# EAGLE design StasDuino_Schematic (EAGLE 9.5.2)
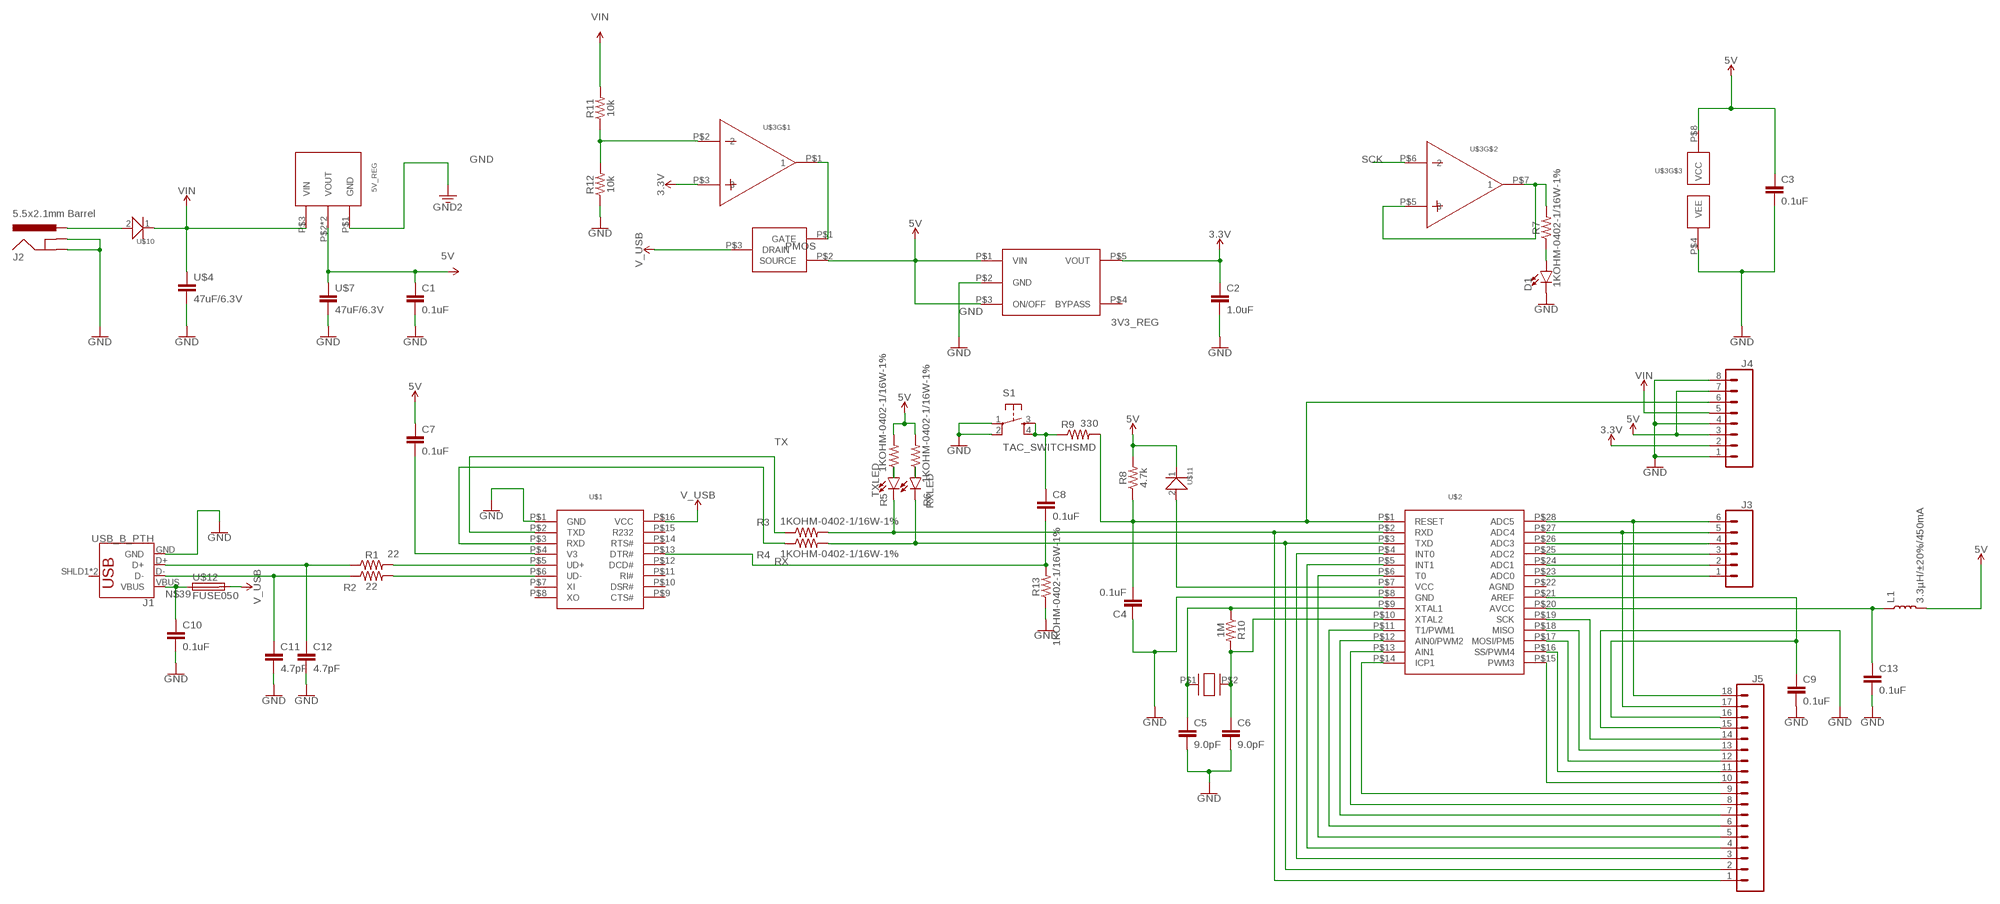
[diagram p0: schematic, sheet 1]

## Parts
3V3_REG  3V3_REGULATOR  [3V3-REGULATOR]
5V_REG  5V_REGULATOR  [5V_REGULATOR]
C1  0.1uF  0.1UF-0402-16V-10%  [0402]
C2  1.0uF  1.0UF-0402-16V-10%  [0402]
C3  0.1uF  0.1UF-0402-16V-10%  [0402]
C4  0.1uF  0.1UF-0402-16V-10%  [0402]
C5  9.0pF  9.0PF-0603-50V-10%  [0603]
C6  9.0pF  9.0PF-0603-50V-10%  [0603]
C7  0.1uF  0.1UF-0402-16V-10%  [0402]
C8  0.1uF  0.1UF-0402-16V-10%  [0402]
C9  0.1uF  0.1UF-0402-16V-10%  [0402]
C10  0.1uF  0.1UF-0402-16V-10%  [0402]
C11  4.7pF  4.7PF-0603-50V-5%  [0603]
C12  4.7pF  4.7PF-0603-50V-5%  [0603]
C13  0.1uF  0.1UF-0402-16V-10%  [0402]
D1  LED0603  [LED-0603]
J1  USB_B_PTH  [USB-B-PTH]
J2  5.5x2.1mm Barrel  POWER_JACKSMD  [POWER_JACK_SMD]
J3  CONN_06NO_SILK_FEMALE_PTH  [1X06_NO_SILK]
J4  CONN_08NO_SILK_FEMALE_PTH  [1X08_NO_SILK]
J5  CONN_18  [1X18_NO_SILK]
L1  3.3µH/±20%/450mA  INDUCTOR-0805-3.3UH  [0805]
PMOS  PMOS  [PMOSFET]
R1  22  22OHM-0402-1/10W-1%  [0402]
R2  22  22OHM-0402-1/10W-1%  [0402]
R3  1KOHM-0402-1/16W-1%  [0402]
R4  1KOHM-0402-1/16W-1%  [0402]
R5  1KOHM-0402-1/16W-1%  [0402]
R6  1KOHM-0402-1/16W-1%  [0402]
R7  1KOHM-0402-1/16W-1%  [0402]
R8  4.7k  4.7KOHM-0603-1/10W-1%  [0603]
R9  330  330OHM-0603-1/10W-1%  [0603]
R10  1M  1MOHM-0603-1/4W-5%  [0603]
R11  10k  10KOHM-0402-1/16W-1%  [0402]
R12  10k  10KOHM-0402-1/16W-1%  [0402]
R13  1KOHM-0402-1/16W-1%  [0402]
RXLED  LED0603  [LED-0603]
S1  TAC_SWITCHSMD  [TACTILE-SWITCH-SMD]
TXLED  LED0603  [LED-0603]
U$1  CH340C  [CH340G/C]
U$2  ATMEGA328P  [ATMEGA328P]
U$3  DUAL_OPAMP  [DUAL_OPAMP]
U$4  47uF/6.3V  47UF  [0805]
U$7  47uF/6.3V  47UF  [0805]
U$8  CRYSTAL  [CRYSTAL]
U$10  DIODE_GEN_PURPDIODE  [0402]
U$11  DIODE_GEN_PURPDIODE  [0402]
U$12  FUSE050  [MF-SMDF050]

## Nets
3.3V: 3V3_REG.P$5(VOUT) C2.1 J4.2 U$3.P$3
5V: 3V3_REG.P$1(VIN) 3V3_REG.P$3(ON/OFF) 5V_REG.P$2(VOUT) 5V_REG.P$2B(VOUT) C1.1 C3.1 C7.1 J4.3 J4.7 L1.2 PMOS.P$2(SOURCE) R5.2 R6.2 R8.2 U$3.P$8(VCC) U$7.1 U$11.1
D+: R1.2 U$1.P$5(UD+)
GND: 3V3_REG.P$2(GND) 5V_REG.P$1(GND) C1.2 C2.2 C3.2 C4.1 C5.2 C6.2 C9.2 C10.2 C11.2 C12.2 C13.2 D1.C J1.GND J2.GND(GNDBREAK) J2.P$4(GND) J4.1 J4.4 J4.8 J5.15 R12.1 R13.1 S1.1 S1.2 U$1.P$1(GND) U$2.P$8(GND) U$3.P$4(VEE) U$4.2 U$7.2 ; supply symbol labelled GND2
N$1: C12.1 J1.D+ R1.1
N$2: C4.2 J4.6 R8.1 R9.2 U$2.P$1(RESET)
N$3: C11.1 J1.D- R2.1
N$4: R2.2 U$1.P$6(UD-)
N$5: J5.2 R4.2 RXLED.C U$2.P$3(TXD)
N$6: J5.1 R3.2 TXLED.C U$2.P$2(RXD)
N$7: C8.1 R9.1 S1.3 S1.4
N$8: R5.1 TXLED.A
N$9: R6.1 RXLED.A
N$10: D1.A R7.1
N$11: R7.2 U$3.P$5 U$3.P$7
N$12: C5.1 R10.1 U$2.P$9(XTAL1) U$8.P$1
N$13: C6.1 R10.2 U$2.P$10(XTAL2) U$8.P$2
N$14: J3.6 J5.18 U$2.P$28(ADC5)
N$15: PMOS.P$1(GATE) U$3.P$1
N$16: J2.VIN0(PWR) U$10.2
N$17: R11.1 R12.2 U$3.P$2
N$18: C7.2 U$1.P$4(V3)
N$19: C8.2 R13.2 U$1.P$13(DTR#)
N$20: U$2.P$7(VCC) U$11.2
N$21: J3.5 J5.17 U$2.P$27(ADC4)
N$22: J3.4 U$2.P$26(ADC3)
N$23: J3.3 U$2.P$25(ADC2)
N$24: J3.2 U$2.P$24(ADC1)
N$25: J3.1 U$2.P$23(ADC0)
N$26: J5.3 U$2.P$4(INT0)
N$27: J5.4 U$2.P$5(INT1)
N$28: J5.5 U$2.P$6(T0)
N$29: J5.6 U$2.P$11(T1/PWM1)
N$30: J5.7 U$2.P$12(AIN0/PWM2)
N$31: J5.8 U$2.P$13(AIN1)
N$32: J5.9 U$2.P$14(ICP1)
N$33: J5.10 U$2.P$15(PWM3)
N$34: J5.11 U$2.P$16(SS/PWM4)
N$35: J5.12 U$2.P$17(MOSI/PM5)
N$36: J5.13 U$2.P$18(MISO)
N$37: J5.14 U$2.P$19(SCK)
N$38: C9.1 J5.16 U$2.P$21(AREF)
N$39: C10.1 J1.VBUS U$12.1
N$40: C13.1 L1.1 U$2.P$20(AVCC)
RX: R4.1 U$1.P$3(RXD)
SCK: U$3.P$6
TX: R3.1 U$1.P$2(TXD)
V_USB: PMOS.P$3(DRAIN) U$1.P$16(VCC) U$12.2
VIN: 5V_REG.P$3(VIN) J4.5 R11.2 U$4.1 U$10.1
Unconnected: 3V3_REG.P$4(BYPASS) J1.SHLD1(SHIELD) J1.SHLD2(SHIELD) U$1.P$7(XI) U$1.P$8(XO) U$1.P$9(CTS#) U$1.P$10(DSR#) U$1.P$11(RI#) U$1.P$12(DCD#) U$1.P$14(RTS#) U$1.P$15(R232) U$2.P$22(AGND)

## Library data of the parts
3V3_REG = StasDuino_Lib:3V3_REGULATOR
5V_REG = StasDuino_Lib:5V_REGULATOR
C1 C3 C4 C7-C10 C13 = StasDuino_Lib:0.1UF: 0.1µF ceramic capacitors A capacitor is a passive two-terminal electrical component used to store electrical energy temporarily in an electric field.; PROD_ID: CAP-12416
C2 = StasDuino_Lib:1.0UF: 1µF ceramic capacitors A capacitor is a passive two-terminal electrical component used to store electrical energy temporarily in an electric field.; PROD_ID: CAP-12417
C5 C6 = SparkFun-Capacitors:9.0PF: 9.0pF ceramic capacitors A capacitor is a passive two-terminal electrical component used to store electrical energy temporarily in an electric field.; PROD_ID: CAP-09341
C11 C12 = SparkFun-Capacitors:4.7PF: 4.7pF ceramic capacitors A capacitor is a passive two-terminal electrical component used to store electrical energy temporarily in an electric field.; PROD_ID: CAP-07880
D1 RXLED TXLED = StasDuino_Lib:LED: LED (Generic) Standard schematic elements and footprints for 5mm, 3mm, 1206, and 0603 sized LEDs. Generic LEDs with no color specified.
J1 = StasDuino_Lib:USB_B: USB Type B Connector SparkFun Products: SparkFun Stepoko <https://www.sparkfun.com/products/13899> PTH; PROD_ID: CONN-08278; SF_ID: PRT-00139
J2 = StasDuino_Lib:POWER_JACK: Power Jack Connector This is the standard 5.5mm barrel jack for power. The PTH is the most common, proven, reliable, footprint. The Slot footprint only works if the mill layer is transmitted to the PCB fab house so be warned. Here are the connectors we sell at SparkFun: DC Barrel Power Jack/Connector <https://www.sparkfun.com/products/119> (PRT-00119) DC Barrel Power Jack/Connector (SMD) <https://www.sparkfun.com/products/12748> (PRT-12748) DC Barrel Jack Adapter - Breadboard Compatible <https://www.sparkfun.com/products/10811> (PRT-10811) It is used on this SparkFun product (and many, many others): SparkFun RedBoard - Programmed with Arduino <https://www.sparkfun.com/products/12757> (DEV-12757) Also, if you need a mating power supply or connector, please check these out: Wall Adapter Power Supply - 9VDC 650mA <https://www.sparkfun.com/products/298> (TOL-00298) DC Barrel Jack Adapter - Male <https://www.sparkfun.com/products/10287> (PRT-10287); PROD_ID: CONN-08106; SF_ID: PRT-12748
J3 = StasDuino_Lib:CONN_06: Multi connection point. Often used as Generic Header-pin footprint for 0.1 inch spaced/style header connections On any of the 0.1 inch spaced packages, you can populate with these: Break Away Headers - Straight <https://www.sparkfun.com/products/116> (PRT-00116) Break Away Male Headers - Right Angle <https://www.sparkfun.com/products/553> (PRT-00553) Female Headers <https://www.sparkfun.com/products/115> (PRT-00115) Break Away Headers - Machine Pin <https://www.sparkfun.com/products/117> (PRT-00117) Break Away Female Headers - Swiss Machine Pin <https://www.sparkfun.com/products/743> (PRT-00743) Arduino Stackable Header - 6 Pin <https://www.sparkfun.com/products/9280> (PRT-09280) For SCREWTERMINALS and SPRING TERMINALS visit here: Screw Terimnals on SparkFun.com <https://www.sparkfun.com/search/results?term=Screw+Terminals> (5mm/3.5mm/2.54mm spacing) This device is also useful as a general connection point to wire up your design to another part of your project. Our various solder wires solder well into these plated through hole pads. Hook-Up Wire - Assortment (Stranded, 22 AWG) <https://www.sparkfun.com/products/11375> (PRT-11375) Hook-Up Wire - Assortment (Solid Core, 22 AWG) <https://www.sparkfun.com/products/11367> (PRT-11367) View the entire wire category on our website here <https://www.sparkfun.com/categories/141>; PROD_ID: CONN-08437
J4 = StasDuino_Lib:CONN_08: Multi connection point. Often used as Generic Header-pin footprint for 0.1 inch spaced/style header connections On any of the 0.1 inch spaced packages, you can populate with these: Break Away Headers - Straight <https://www.sparkfun.com/products/116> (PRT-00116) Break Away Male Headers - Right Angle <https://www.sparkfun.com/products/553> (PRT-00553) Female Headers <https://www.sparkfun.com/products/115> (PRT-00115) Break Away Headers - Machine Pin <https://www.sparkfun.com/products/117> (PRT-00117) Break Away Female Headers - Swiss Machine Pin <https://www.sparkfun.com/products/743> (PRT-00743) Arduino Stackable Header - 8 Pin <https://www.sparkfun.com/products/9279> (PRT-09279) For SCREWTERMINALS and SPRING TERMINALS visit here: Screw Terimnals on SparkFun.com <https://www.sparkfun.com/search/results?term=Screw+Terminals> (5mm/3.5mm/2.54mm spacing) This device is also useful as a general connection point to wire up your design to another part of your project. Our various solder wires solder well into these plated through hole pads. Hook-Up Wire - Assortment (Stranded, 22 AWG) <https://www.sparkfun.com/products/11375> (PRT-11375) Hook-Up Wire - Assortment (Solid Core, 22 AWG) <https://www.sparkfun.com/products/11367> (PRT-11367) View the entire wire category on our website here <https://www.sparkfun.com/categories/141> Special notes: Molex polarized connector foot print use with SKU : PRT-08231 with associated crimp pins and housings. 1MM SMD Version SKU: PRT-10208 NOTES ON THE VARIANTS LOCK and LOCK_LONGPADS... This footprint was designed to help hold the alignment of a through-hole component (i.e. 6-pin header) while soldering it into place. You may notice that each hole has been shifted either up or down by 0.005 of an inch from it's more standard position (which is a perfectly straight line). This slight alteration caused the pins (the squares in the middle) to touch the edges of the holes. Because they are alternating, it causes a "brace" to hold the component in place. 0.005 has proven to be the perfect amount of "off-center" position when using our standard breakaway headers. Although looks a little odd when you look at the bare footprint, once you have a header in there, the alteration is very hard to notice. Also,if you push a header all the way into place, it is covered up entirely on the bottom side.; PROD_ID: CONN-08438
J5 = StasDuino_Lib:CONN_18: Multi connection point. Often used as Generic Header-pin footprint for 0.1 inch spaced/style header connections On any of the 0.1 inch spaced packages, you can populate with these: Break Away Headers - Straight <https://www.sparkfun.com/products/116> (PRT-00116) Break Away Male Headers - Right Angle <https://www.sparkfun.com/products/553> (PRT-00553) Female Headers <https://www.sparkfun.com/products/115> (PRT-00115) Break Away Headers - Machine Pin <https://www.sparkfun.com/products/117> (PRT-00117) Break Away Female Headers - Swiss Machine Pin <https://www.sparkfun.com/products/743> (PRT-00743) For SCREWTERMINALS and SPRING TERMINALS visit here: Screw Terimnals on SparkFun.com <https://www.sparkfun.com/search/results?term=Screw+Terminals> (5mm/3.5mm/2.54mm spacing) This device is also useful as a general connection point to wire up your design to another part of your project. Our various solder wires solder well into these plated through hole pads. Hook-Up Wire - Assortment (Stranded, 22 AWG) <https://www.sparkfun.com/products/11375> (PRT-11375) Hook-Up Wire - Assortment (Solid Core, 22 AWG) <https://www.sparkfun.com/products/11367> (PRT-11367) View the entire wire category on our website here <https://www.sparkfun.com/categories/141> Special notes: Molex polarized connector foot print use with SKU : PRT-08231 with associated crimp pins and housings. 1MM SMD Version SKU: PRT-10208 NOTES ON THE VARIANTS LOCK and LOCK_LONGPADS... This footprint was designed to help hold the alignment of a through-hole component (i.e. 6-pin header) while soldering it into place. You may notice that each hole has been shifted either up or down by 0.005 of an inch from it's more standard position (which is a perfectly straight line). This slight alteration caused the pins (the squares in the middle) to touch the edges of the holes. Because they are alternating, it causes a "brace" to hold the component in place. 0.005 has proven to be the perfect amount of "off-center" position when using our standard breakaway headers. Although looks a little odd when you look at the bare footprint, once you have a header in there, the alteration is very hard to notice. Also,if you push a header all the way into place, it is covered up entirely on the bottom side.
L1 = SparkFun-Coils:INDUCTOR: Inductors Resist changes in electrical current. Basically a coil of wire. SparkFun Products: SparkFun Load Cell Amplifier - HX711 <https://www.sparkfun.com/products/13879> IOIO-OTG - V2.2 <https://www.sparkfun.com/products/13613>; PROD_ID: NDUC-13076
PMOS = StasDuino_Lib:PMOS
R1 R2 = StasDuino_Lib:22OHM: 22Ω resistor A resistor is a passive two-terminal electrical component that implements electrical resistance as a circuit element. Resistors act to reduce current flow, and, at the same time, act to lower voltage levels within circuits. - Wikipedia; PROD_ID: RES-12427
R3-R7 R13 = StasDuino_Lib:1KOHM: 1kΩ resistor A resistor is a passive two-terminal electrical component that implements electrical resistance as a circuit element. Resistors act to reduce current flow, and, at the same time, act to lower voltage levels within circuits. - Wikipedia; PROD_ID: RES-14342
R8 = StasDuino_Lib:4.7KOHM: 4.7kΩ resistor A resistor is a passive two-terminal electrical component that implements electrical resistance as a circuit element. Resistors act to reduce current flow, and, at the same time, act to lower voltage levels within circuits. - Wikipedia; PROD_ID: RES-07857
R9 = StasDuino_Lib:330OHM: 330Ω resistor A resistor is a passive two-terminal electrical component that implements electrical resistance as a circuit element. Resistors act to reduce current flow, and, at the same time, act to lower voltage levels within circuits. - Wikipedia; PROD_ID: RES-00818
R10 = StasDuino_Lib:1MOHM: 1MΩ resistor A resistor is a passive two-terminal electrical component that implements electrical resistance as a circuit element. Resistors act to reduce current flow, and, at the same time, act to lower voltage levels within circuits. - Wikipedia; PROD_ID: RES-07868
R11 R12 = StasDuino_Lib:10KOHM: 10kΩ resistor A resistor is a passive two-terminal electrical component that implements electrical resistance as a circuit element. Resistors act to reduce current flow, and, at the same time, act to lower voltage levels within circuits. - Wikipedia; PROD_ID: RES-14241
S1 = StasDuino_Lib:TAC_SWITCH: Momentary Switch Button commonly used for reset or general input. Spark Fun Electronics SKU : COM-00097 SMT- SWCH-08247; PROD_ID: SWCH-08247
U$1 = StasDuino_Lib:CH340C
U$2 = StasDuino_Lib:ATMEGA328P
U$3 = StasDuino_Lib:DUAL_OPAMP
U$4 U$7 = StasDuino_Lib:47UF; PROD_ID: CAP-13854
U$8 = StasDuino_Lib:CRYSTAL
U$10 U$11 = StasDuino_Lib:DIODE_GEN_PURP
U$12 = StasDuino_Lib:FUSE: MF-SMDF Series - PRC Resettable Fuses Source: http://www.farnell.com/datasheets/716597.pdf

## Board
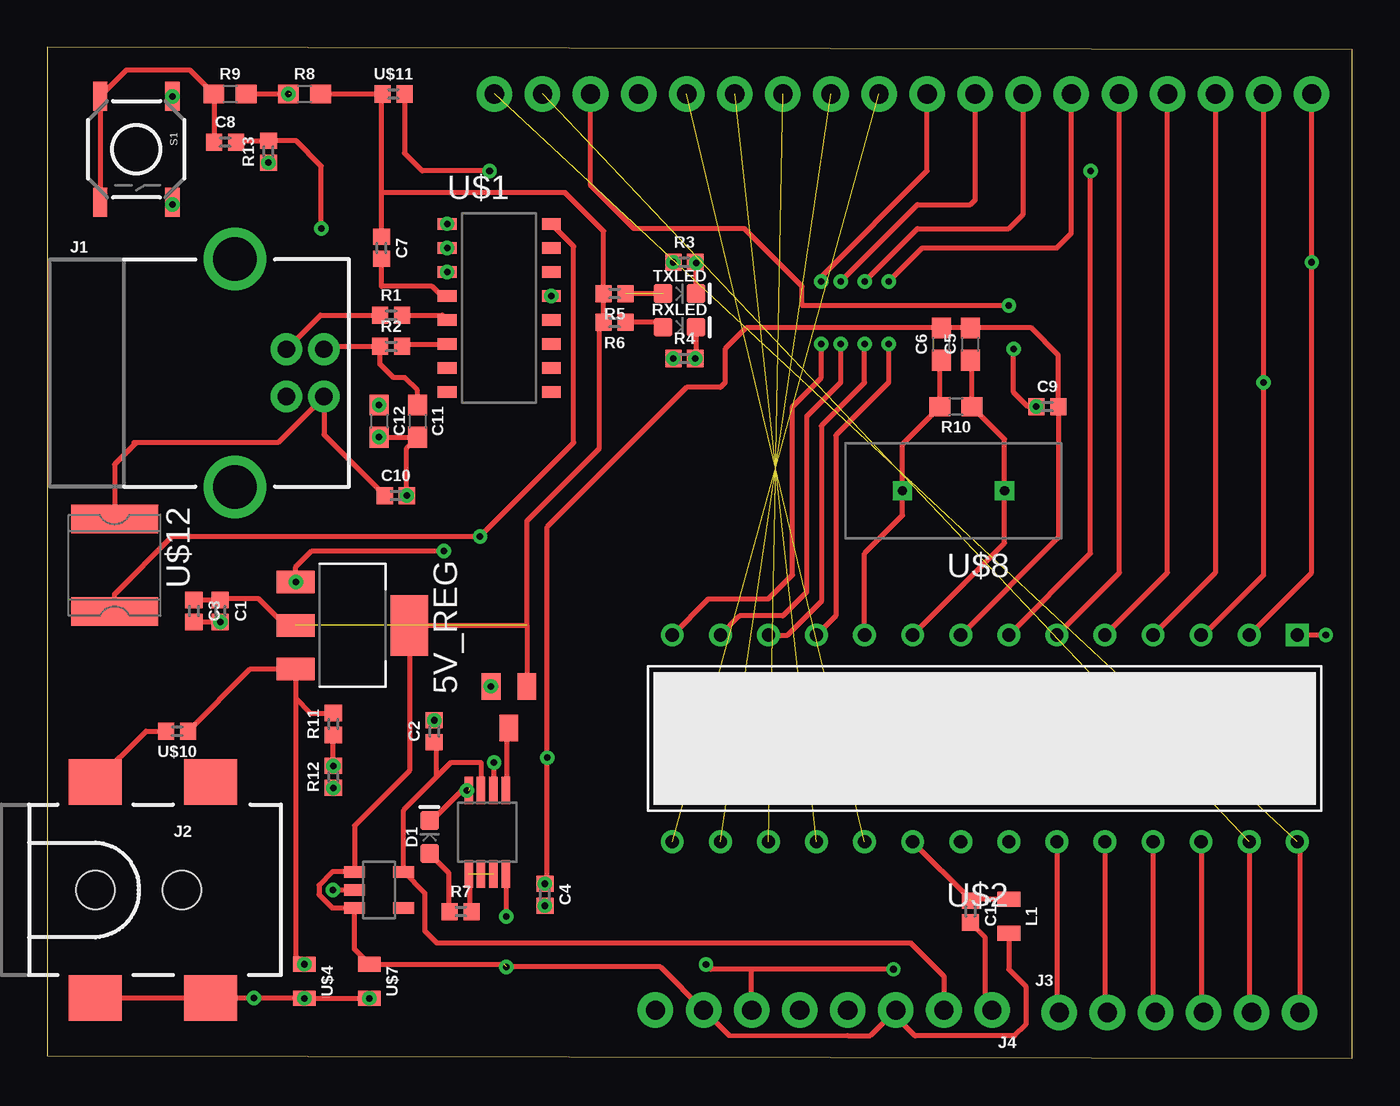
[diagram p1: board, top side]
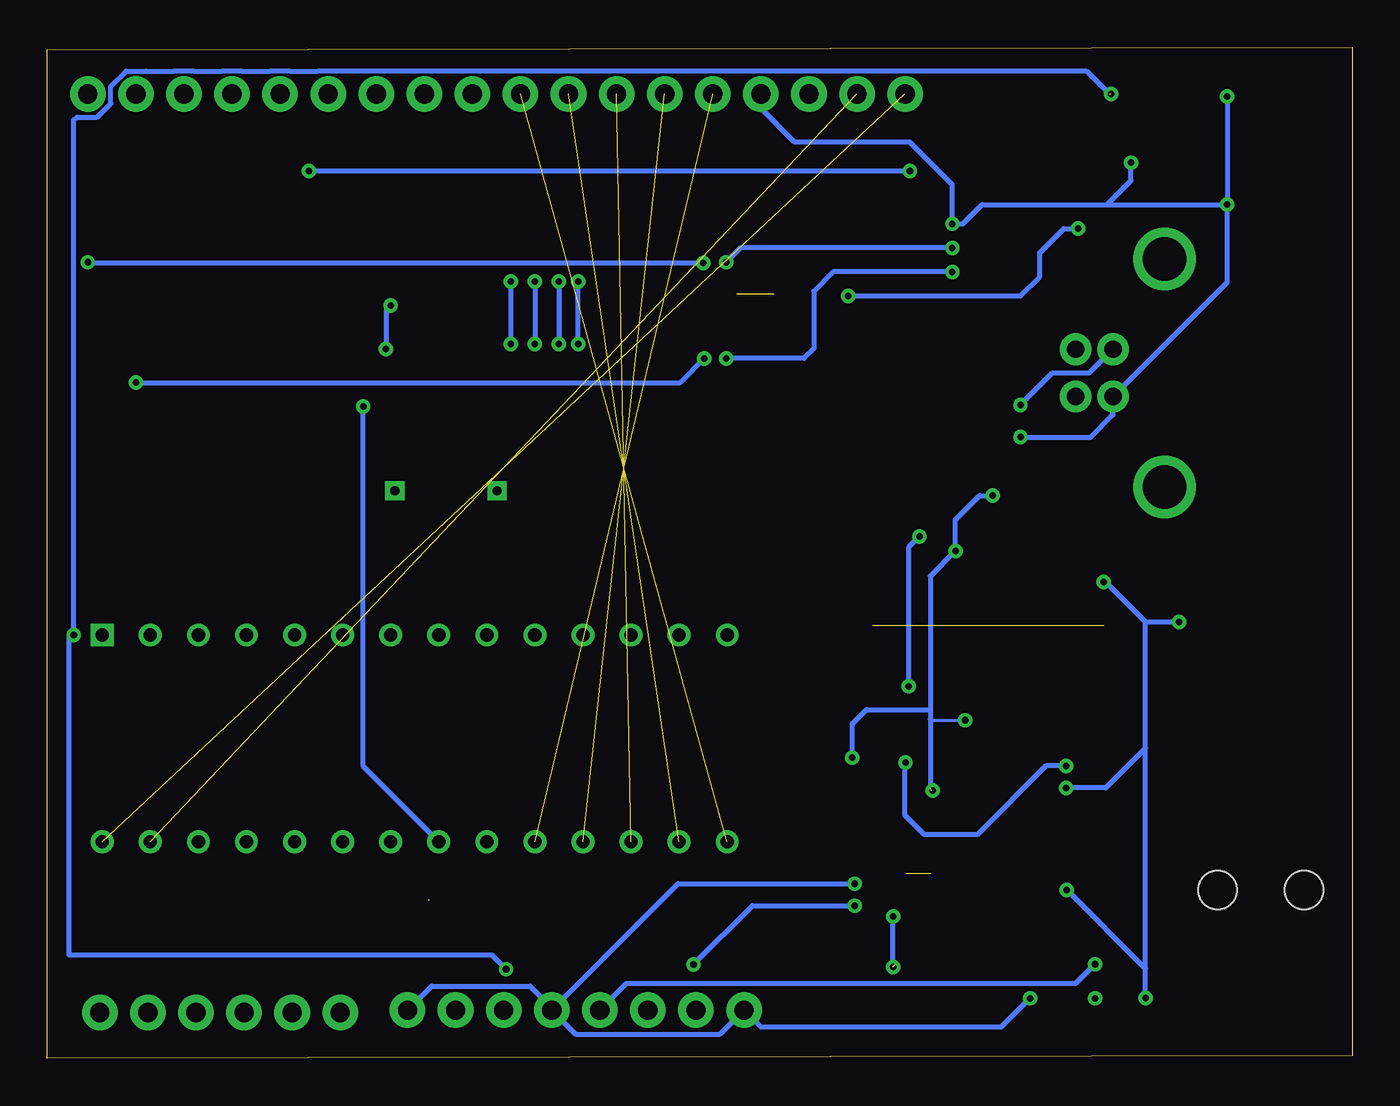
[diagram p2: board, bottom side, seen from below]

Size 68.94 x 53.39 mm. Coordinates in mm from the lower left corner, seen from the top.
Outline: 0,0.13 68.94,0 68.94,53.26 0,53.39 0,0.13
Copper layers (1*16): Top 0.035mm / dielectric 1.5mm / Bottom 0.035mm
Design rules "default": minimum track width 6mil, minimum drill 0.35mm, track to track 6mil, track to pad 6mil, pad to pad 6mil, via to via 6mil, smd to smd 6mil, copper to edge 40mil, drill to drill 6mil, minimum pad ring 10mil, minimum via ring 8mil, stop-mask expansion 4mil, vias tented up to drill 0mil, thermal gap 10mil

### Footprints (pad centres in the part's own frame; a part is rotated, then mirrored left to right if it is on the bottom)
3V3-REGULATOR = smd 1.1 x 0.6: P$1 -1.3,0.95; P$2 -1.3,0; P$3 -1.3,-0.95; P$4 1.3,-0.95; P$5 1.3,0.95
5V_REGULATOR = smd 1.2 x 2: P$1 -2.3,-3; P$2 0,-3; P$3 2.3,-3 | smd 3.2 x 2: P$2B 0,3
0402 = smd 0.85 x 0.9: 1 -0.58,0; 2 0.58,0
0603 = smd 1.1 x 1: 1 -0.85,0; 2 0.85,0
LED-0603 = smd 1 x 1: A -0.877,0; C 0.877,0
USB-B-PTH = drill 0.914 pad 1.676: D+ 4,1.25; D- 5.981,1.25; GND 4,-1.25; VBUS 5.981,-1.25 | drill 2.286: SHLD1 1.282,-6.02; SHLD2 1.282,6.02
POWER_JACK_SMD = smd 2.8 x 2.4: GND 0,-5.7; P$4 6.1,-5.7; VIN0 0,5.7; VIN1 6.1,5.7 | hole 2.032: 0,0; 4.572,0
1X06_NO_SILK = drill 1.016 pad 1.88: 1 0,0; 2 2.54,0; 3 5.08,0; 4 7.62,0; 5 10.16,0; 6 12.7,0
1X08_NO_SILK = drill 1.016 pad 1.88: 1 0,0; 2 2.54,0; 3 5.08,0; 4 7.62,0; 5 10.16,0; 6 12.7,0; 7 15.24,0; 8 17.78,0
1X18_NO_SILK = drill 1.016 pad 1.88: 1 0,0; 2 2.54,0; 3 5.08,0; 4 7.62,0; 5 10.16,0; 6 12.7,0; 7 15.24,0; 8 17.78,0; 9 20.32,0; 10 22.86,0; 11 25.4,0; 12 27.94,0; 13 30.48,0; 14 33.02,0; 15 35.56,0; 16 38.1,0; 17 40.64,0; 18 43.18,0
0805 = smd 0.8 x 1.2: 1 -0.9,0; 2 0.9,0
PMOSFET = smd 1 x 1.4: P$1 0,1.1; P$2 -0.95,-1.1; P$3 0.95,-1.1
TACTILE-SWITCH-SMD = smd 1.524 x 0.762: 1 -2.794,1.905; 2 2.794,1.905; 3 -2.794,-1.905; 4 2.794,-1.905
CH340G/C = smd 1 x 0.6: P$1 -2.75,4.445; P$2 -2.75,3.175; P$3 -2.75,1.905; P$4 -2.75,0.635; P$5 -2.75,-0.635; P$6 -2.75,-1.905; P$7 -2.75,-3.175; P$8 -2.75,-4.445; P$9 2.75,-4.445; P$10 2.75,-3.175; P$11 2.75,-1.905; P$12 2.75,-0.635; P$13 2.75,0.635; P$14 2.75,1.905; P$15 2.75,3.175; P$16 2.75,4.445
ATMEGA328P = drill 0.7 square: P$1 -16.51,-5.461 | drill 0.7: P$2 -13.97,-5.461; P$3 -11.43,-5.461; P$4 -8.89,-5.461; P$5 -6.35,-5.461; P$6 -3.81,-5.461; P$7 -1.27,-5.461; P$8 1.27,-5.461; P$9 3.81,-5.461; P$10 6.35,-5.461; P$11 8.89,-5.461; P$12 11.43,-5.461; P$13 13.97,-5.461; P$14 16.51,-5.461; P$15 16.51,5.461; P$16 13.97,5.461; P$17 11.43,5.461; P$18 8.89,5.461; P$19 6.35,5.461; P$20 3.81,5.461; P$21 1.27,5.461; P$22 -1.27,5.461; P$23 -3.81,5.461; P$24 -6.35,5.461; P$25 -8.89,5.461; P$26 -11.43,5.461; P$27 -13.97,5.461; P$28 -16.51,5.461
DUAL_OPAMP = smd 0.45 x 1.45: P$1 -0.975,-2.2; P$2 -0.325,-2.2; P$3 0.325,-2.2; P$4 0.975,-2.2; P$5 0.975,2.2; P$6 0.325,2.2; P$7 -0.325,2.2; P$8 -0.975,2.2
CRYSTAL = drill 0.5 square: P$1 -2.7,0; P$2 2.7,0
MF-SMDF050 = smd 1.5 x 4.6: 1 -2.45,0; 2 2.45,0

### Placement (x,y rotation side)
3V3_REG  17.53,8.89 0 top
5V_REG  16.13,22.86 270 top
C1  9.14,23.62 270 top
C2  20.45,17.27 90 top
C3  7.75,23.62 270 top
C4  26.29,8.64 270 top
C5  48.77,37.72 90 top
C6  47.24,37.72 90 top
C7  17.65,42.8 270 top
C8  9.4,48.39 0 top
C9  52.83,34.42 0 top
C10  18.41,29.72 0 top
C11  19.56,33.66 270 top
C12  17.53,33.66 270 top
C13  48.77,7.75 270 top
D1  20.19,11.68 90 top
J1  8.64,36.2 0 top
J2  2.54,8.89 0 top
J3  53.47,2.41 0 top
J4  49.91,2.54 180 top
J5  66.8,50.93 180 top
L1  50.8,7.49 270 top
PMOS  24.38,18.54 180 top
R1  18.16,39.24 0 top
R2  18.16,37.59 0 top
R3  33.66,42.04 0 top
R4  33.66,36.96 0 top
R5  29.97,40.39 180 top
R6  29.97,38.86 180 top
R7  21.84,7.75 0 top
R8  13.59,50.93 0 top
R9  9.65,50.93 0 top
R10  48.01,34.42 180 top
R11  15.11,17.65 90 top
R12  15.11,14.86 90 top
R13  11.68,47.88 90 top
RXLED  33.4,38.61 0 top
S1  4.7,48.01 270 top
TXLED  33.4,40.39 0 top
U$1  23.88,39.62 0 top
U$2  49.53,16.89 180 top
U$3  23.24,11.94 180 top
U$4  13.59,4.06 270 top
U$7  17.02,4.06 270 top
U$8  47.88,29.97 180 top
U$10  6.86,17.27 180 top
U$11  18.29,50.93 0 top
U$12  3.56,26.04 270 top

### Tracks (layer width: path | path; a pad name or v marks a point on that pad's centre or on a via)
3.3V
  Top 0.254: J4.2 47.37,4.32 45.59,6.1 20.57,6.1 19.94,6.73 19.94,8.73 3V3_REG.P$5 18.83,13.11 20.57,14.86 | 20.57,14.86 21.34,15.62 22.92,15.62 U$3.P$3 | 20.57,14.86 20.57,16.56 C2.1
5V  (via drill 0.35)  (2 unrouted)
  Top 0.254: 25.33,22.86 5V_REG.P$2B 19.13,15.19 16.23,12.29 3V3_REG.P$1 15.05,9.84 14.35,9.14 14.35,8.64 15.05,7.94 3V3_REG.P$3 16.23,5.76 U$7.1 24.13,4.96 | 17.65,45.72 27.36,45.72 29.39,43.69 R5.2 R6.2 29.14,38.61 29.14,32.19 25.33,28.38 25.33,22.86 | v24.26,4.83 32.38,4.83 J4.7 36.01,1.2 42.29,1.19 43.48,1.19 J4.3 44.83,2.2 45.85,1.19 51.1,1.19 51.69,1.78 51.69,3.81 50.8,4.7 L1.2 | C7.1 17.65,45.72 | 17.65,50.87 U$11.1 | v24.26,7.49 24.26,9.7 U$3.P$8 | 5V_REG.P$2 12.57,22.86 11.18,24.26 9.2,24.26 C1.1 C3.1 | 25.33,22.86 PMOS.P$2 | R8.2 17.6,50.93 17.65,50.87 | 17.65,45.72 17.65,50.87
  Bottom 0.254: v24.26,4.83 v24.26,7.49
D+
  Top 0.254: R1.2 20.87,39.24 U$1.P$5
GND  (via drill 0.35)  (1 unrouted)
  Top 0.152: 10.95,3.16 v10.93,3.18 | 21.9,14.14 v22.16,14.14 U$3.P$4
  Top 0.254: J2.GND J2.P$4 v10.92,3.19 | v15.08,8.89 3V3_REG.P$2 | 21.9,14.14 20.32,12.56 D1.C | C13.2 49.53,6.4 49.53,2.92 J4.1 | C3.2 v9.14,23.04 | 5V_REG.P$1 13.13,25.96 13.97,26.8 v20.95,26.8 | S1.2 v6.6,45.09 | U$7.2 U$4.2 13.56,3.19 v10.92,3.19 | v10.92,3.19 v10.93,3.18 | v19,29.72 19,32.24 19.48,32.72 | 19.48,32.72 C11.2 | C12.2 19.39,32.8 19.48,32.72 | C4.1 26.42,9.34 v26.42,15.88 26.42,28.07 33.78,35.43 35.56,35.43 35.81,35.69 35.81,37.47 36.92,38.57 C6.2 C5.2 51.98,38.57 53.41,37.14 C9.2 53.41,27.5 U$2.P$8
  Bottom 0.152: 22.29,17.91 22.23,17.85 v20.45,17.85 | 9.2,22.99 v9.14,23.04
  Bottom 0.254: S1.1 v6.6,45.09 | J4.4 41.02,1.27 33.4,1.27 J4.8 31.24,1.65 18.53,1.65 U$7.2 | v10.92,3.19 10.92,4.73 | J4.1 48.64,3.81 43.43,3.81 42.29,2.67 J4.4 | 10.92,4.73 v15.08,8.89 | 10.92,4.73 10.92,16.38 | 10.92,16.38 10.92,23.04 | 22.29,18.41 22.29,25.46 v20.95,26.8 20.95,28.45 19.68,29.72 v19,29.72 | 22.29,18.41 22.29,17.91 22.29,14.27 | 10.92,23.04 9.25,23.04 9.2,22.99 | 10.92,23.04 13.04,25.16 5V_REG.P$1 | 10.92,16.38 13.03,14.28 R12.1 | C12.2 13.8,32.8 12.64,33.97 J1.GND 6.6,40.98 v6.6,45.09 | J5.15 31.24,50.16 29.46,48.39 23.37,48.39 21.13,46.15 U$1.P$1 20.57,44.07 19.56,45.09 12.95,45.09 | J4.4 35.62,9.22 C4.1 | v26.42,15.88 26.42,17.65 25.65,18.41 22.29,18.41 | 12.95,45.09 v6.6,45.09 | 12.95,45.09 11.68,46.36 R13.1
  other vias: 13.59,3.16 17.02,3.16 13.13,25.16 6.6,50.8 15.11,14.28 17.53,32.8 12.64,34.95 21.13,44.07 31.24,50.93 26.29,9.22 48.26,22.35 11.68,47.3
N$1  (via drill 0.35)
  Top 0.254: J1.D+ 14.43,39.24 R1.1
  Bottom 0.254: C12.1 15.84,36.2 13.89,36.2 J1.D+
  other vias: 17.53,34.51 12.64,37.45
N$2  (via drill 0.35)  (1 unrouted)
  Top 0.254: v67.55,22.35 U$2.P$1 | v44.7,4.7 37.21,4.7 | J4.6 37.21,4.7 | R9.2 R8.1 | 37.21,4.7 35.05,4.7 v34.8,4.95
  Bottom 0.254: 12.83,50.93 14.05,52.15 54.61,52.15 54.62,52.13 56.12,52.13 56.14,52.15 57.15,52.15 57.16,52.13 58.66,52.13 58.68,52.15 59.69,52.15 59.7,52.13 61.2,52.13 61.22,52.15 62.23,52.15 62.24,52.13 63.74,52.13 64.78,52.13 65.58,51.33 65.58,50.42 66.3,49.71 67.39,49.71 67.56,49.53 67.55,49.51 v67.55,22.35 67.8,22.35 67.8,5.46 45.47,5.46 v44.7,4.7 | v34.8,4.95 31.7,8.06 C4.2
  other vias: 12.74,50.93 26.29,8.06
N$3
  Top 0.254: J1.D- 14.76,37.59 R2.1 17.58,36.65 18.29,35.94 18.88,35.94 19.56,35.27 C11.1
N$4
  Top 0.254: R2.2 18.87,37.72 U$1.P$6
N$5  (via drill 0.35)
  Top 0.254: U$2.P$3 61.09,22.35 64.26,25.53 v64.26,35.69 J5.2 | RXLED.C 34.28,37 R4.2
  Bottom 0.254: v64.26,35.69 35.51,35.69 R4.2
  other vias: 34.23,36.96
N$6  (via drill 0.35)
  Top 0.254: U$2.P$2 66.8,25.65 v66.8,42.04 J5.1 66.86,50.86 | TXLED.C v34.28,41.99 R3.2
  Bottom 0.254: v34.28,41.99 66.76,41.99 v66.8,42.04
N$7
  Top 0.254: S1.4 S1.3 4.19,52.2 7.53,52.2 R9.1 8.82,50.91 C8.1
N$8  (1 unrouted)
  Top 0.254: TXLED.A R5.1
N$9
  Top 0.254: RXLED.A 32.27,38.86 R6.1
N$10
  Top 0.254: R7.1 21.21,7.8 21.21,9.79 D1.A
N$11  (1 unrouted)
  Top 0.254: U$3.P$5 22.3,9.71 22.3,7.87 R7.2
N$12
  Top 0.254: U$2.P$9 50.58,27.21 U$8.P$1 50.58,32.69 R10.1 48.86,36.78 C5.1
N$13
  Top 0.254: U$2.P$10 43.18,26.67 45.18,28.67 U$8.P$2 45.18,32.44 R10.2 47.16,36.78 C6.1
N$14  (1 unrouted)
  Top 0.254: U$2.P$28 66.17,11.3 J3.6
N$15
  Top 0.254: PMOS.P$1 24.26,17.31 24.26,14.18 U$3.P$1
N$16
  Top 0.254: J2.VIN0 5.22,17.27 U$10.2
N$17  (via drill 0.35)
  Top 0.254: R12.2 R11.1 | U$3.P$2 23.6,14.17 v23.6,15.62
  Bottom 0.254: R12.2 16.18,15.44 19.81,11.81 22.61,11.81 23.62,12.83 23.62,15.6 v23.6,15.62
  other vias: 15.11,15.44
N$18
  Top 0.254: U$1.P$4 20.83,40.26 20.32,40.77 17.65,40.77 C7.2
N$19  (via drill 0.35)
  Top 0.254: C8.2 10.05,48.46 R13.2 13.14,48.46 14.48,47.12 v14.48,43.82
  Bottom 0.254: v14.48,43.82 15.24,43.82 16.51,42.55 16.51,41.28 17.53,40.26 U$1.P$13
  other vias: 26.63,40.26
N$20  (via drill 0.35)
  Top 0.254: U$2.P$7 55.12,26.67 v55.12,46.86 | U$11.2 18.87,47.81 19.81,46.86 v23.37,46.86
  Bottom 0.254: v55.12,46.86 v23.37,46.86
N$21  (1 unrouted)
  Top 0.254: U$2.P$27 63.5,2.54 J3.5
N$22
  Top 0.254: U$2.P$26 60.96,2.54 J3.4
N$23
  Top 0.254: U$2.P$25 58.42,2.54 J3.3
N$24
  Top 0.254: U$2.P$24 55.88,2.54 J3.2
N$25
  Top 0.254: U$2.P$23 53.34,2.54 J3.1
N$26
  Top 0.254: J5.3 61.72,25.65 U$2.P$4
N$27
  Top 0.254: U$2.P$5 59.18,25.65 J5.4
N$28
  Top 0.254: U$2.P$6 56.64,25.65 J5.5
N$29  (via drill 0.35)
  Top 0.254: U$2.P$11 41.66,23.37 41.66,32.89 44.45,35.69 v44.45,37.72 | v44.45,41.02 46.23,42.8 53.34,42.8 54.1,43.56 J5.6
  Bottom 0.254: v44.45,37.72 v44.45,41.02
N$30  (via drill 0.35)
  Top 0.254: U$2.P$12 39.12,22.35 40.89,24.13 40.89,33.4 43.18,35.69 v43.18,37.72 | v43.18,41.02 45.97,43.82 50.8,43.82 51.56,44.58 J5.7
  Bottom 0.254: v43.18,41.02 v43.18,37.72
N$31  (via drill 0.35)
  Top 0.254: U$2.P$13 36.58,23.37 38.86,23.37 40.13,24.64 40.13,33.91 41.91,35.69 v41.91,37.72 | v41.91,41.02 45.97,45.09 48.77,45.09 49.02,45.34 J5.8
  Bottom 0.254: v41.91,41.02 v41.91,37.72
N$32  (via drill 0.35)
  Top 0.254: U$2.P$14 34.92,24.26 38.1,24.26 39.37,25.53 39.37,34.42 40.89,35.94 v40.89,37.72 | v40.89,41.02 40.89,41.28 46.48,46.86 J5.9
  Bottom 0.254: v40.89,37.72 v40.89,41.02
N$33  (1 unrouted)
N$34  (1 unrouted)
N$35  (1 unrouted)
N$36  (1 unrouted)
N$37  (1 unrouted)
N$38  (via drill 0.35)
  Top 0.254: v50.8,39.75 39.88,39.75 39.88,40.77 36.83,43.82 30.99,43.82 28.7,46.1 J5.16 | C9.1 51.82,34.42 51.05,35.18 v51.05,37.47
  Bottom 0.254: v51.05,37.47 51.05,39.75 v50.8,39.75 | U$2.P$21 52.25,15.42 C9.1
  other vias: 48.26,11.43 52.25,34.42
N$39
  Top 0.254: 4.7,32.51 12.18,32.51 J1.VBUS 14.62,32.94 C10.1 | 4.7,32.51 4.57,32.51 | 4.7,32.51 3.56,31.37 U$12.1
N$40  (1 unrouted)
  Top 0.254: L1.1 48.76,8.39 U$2.P$20
RX  (via drill 0.35)
  Bottom 0.254: U$1.P$3 27.43,41.53 28.45,40.51 28.45,37.47 28.96,36.96 R4.1
  other vias: 21.13,41.53 33.08,36.96
TX  (via drill 0.35)
  Bottom 0.254: U$1.P$2 32.31,42.8 R3.1
  other vias: 21.13,42.8 33.08,42.04
V_USB  (via drill 0.35)
  Top 0.254: U$12.2 3.56,24.51 6.6,27.56 v22.86,27.56 27.81,32.51 27.81,42.88 U$1.P$16
  Bottom 0.254: PMOS.P$3 23.43,26.98 v22.86,27.56
  other vias: 23.43,19.64
VIN  (via drill 0.35)
  Top 0.254: U$10.1 10.73,20.56 5V_REG.P$3 13.13,19 | R11.2 13.9,18.23 13.13,19 | 13.13,19 13.13,5.42 U$4.1
  Bottom 0.254: U$4.1 14.62,3.94 38.35,3.94 J4.5
  other vias: 13.59,4.96